# Altium schematic sheet INT_REG.SchDoc
size A4; SheetNumber: 9; SheetTotal: 12
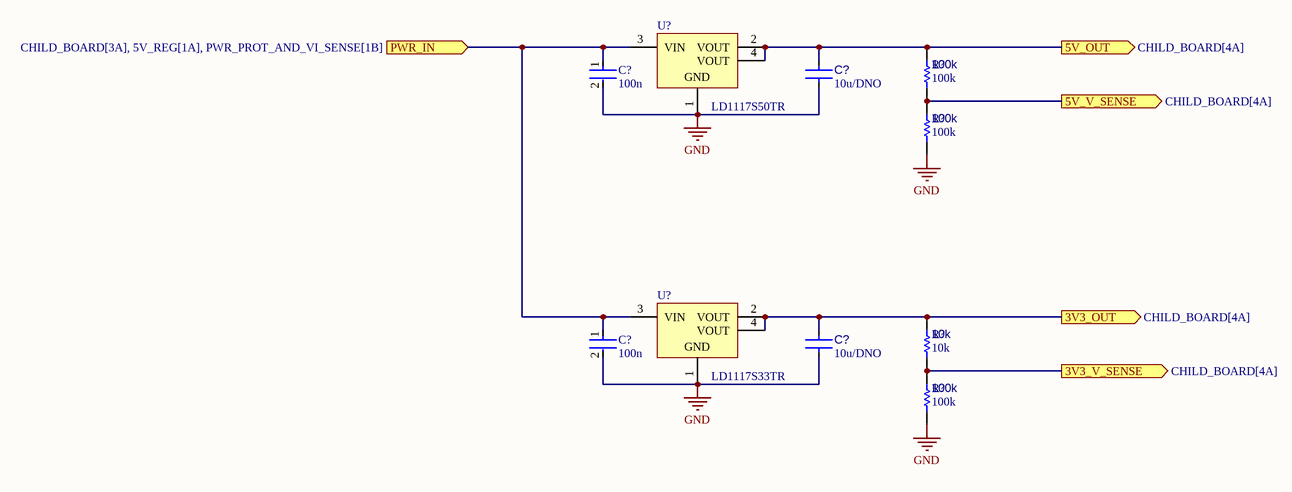
[diagram p0: INT_REG.SchDoc]

## Parts
(Parts that share a designator on the sheet are numbered #1, #2 ... from top to bottom, then left to right.)
C?#1  100n  [FP-0402-L_1_0_0_05-W_0_5-IPC_A]
C?#2  10u/DNO  [C0805A]
C?#3  100n  [FP-0402-L_1_0_0_05-W_0_5-IPC_A]
C?#4  10u/DNO  [C0805A]
R?#1  100k  [R0603B]
R?#2  100k  [R0603B]
R?#3  10k  [R0603B]
R?#4  100k  [R0603B]
U?#1  LD1117S50TR  [SOT-223_L]
U?#2  LD1117S33TR  [SOT-223_L]

## Ports
3V3_OUT (out, see CHILD_BOARD[4A]), 3V3_V_SENSE (out, see CHILD_BOARD[4A]), 5V_OUT (out, see CHILD_BOARD[4A]), 5V_V_SENSE (out, see CHILD_BOARD[4A]), PWR_IN (in, see CHILD_BOARD[3A], 5V_REG[1A], PWR_PROT_AND_VI_SENSE[1B])

## Nets
GND: C?#1.2 C?#2.2 C?#3.2 C?#4.2 R?#2.2 R?#4.2 U?#1.1(GND) U?#2.1(GND)
3V3_OUT: C?#4.1 R?#3.1 U?#2.2(VOUT) U?#2.4(VOUT) ; port 3V3_OUT
3V3_V_SENSE: R?#3.2 R?#4.1 ; port 3V3_V_SENSE
5V_OUT: C?#2.1 R?#1.1 U?#1.2(VOUT) U?#1.4(VOUT) ; port 5V_OUT
5V_V_SENSE: R?#1.2 R?#2.1 ; port 5V_V_SENSE
PWR_IN: C?#1.1 C?#3.1 U?#1.3(VIN) U?#2.3(VIN) ; port PWR_IN

## Library data of the parts
C?#1 C?#3 = CMP-001-00058-1: LARGE PADS, 0402 CAP, CHANGE COMMENT TO MATCH REAL P/N; Capacitor Type: Ceramic; Min Operating Temperature: -55°C; Mounting Technology: Surface Mount; Pins: 2; Case/Package: 0402; RoHS Compliant: Yes; Max Operating Temperature: 85°C
C?#2 C?#4 = CMP-001-00000-11: Non-polarized capacitor
R?#1-R?#4 = CMP-009-00002-14: Resistor
  R?#1 R?#2 R?#4: Value: 100k
  R?#3: Value: 10k
U?#1 = CMP-0244-00312-1: Fixed Low Drop Positive Voltage Regulator, 5V, 4-Pin SOT-223, Tape and Reel; ComponentLink1URL: http://www.st.com; DatasheetVersion: 1/11/2011; PackageDescription: 4-Pin SOT-223 Package, 6.5 x 3.5 mm Body, 2.3 mm Pitch, 7 mm Lead Span; ComponentLink2URL: http://www.st.com/internet/com/TECHNICAL_RESOURCES/TECHNICAL_LITERATURE/DATASHEET/CD00000544.pdf; ComponentLink1Description: Manufacturer URL; PackageReference: SOT-223; PackageVersion: 2010; ComponentLink2Description: Datasheet
U?#2 = CMP-0244-00310-1: Fixed Low Drop Positive Voltage Regulator, 3.3V, 4-Pin SOT-223, Tape and Reel; ComponentLink2Description: Datasheet; PackageDescription: 4-Pin SOT-223 Package, 6.5 x 3.5 mm Body, 2.3 mm Pitch, 7 mm Lead Span; PackageVersion: 2010; ComponentLink2URL: http://www.st.com/internet/com/TECHNICAL_RESOURCES/TECHNICAL_LITERATURE/DATASHEET/CD00000544.pdf; PackageReference: SOT-223; DatasheetVersion: 1/11/2011; ComponentLink1Description: Manufacturer URL; ComponentLink1URL: http://www.st.com